# Altium schematic sheet Sensors.SchDoc
size A4; SheetNumber: 9
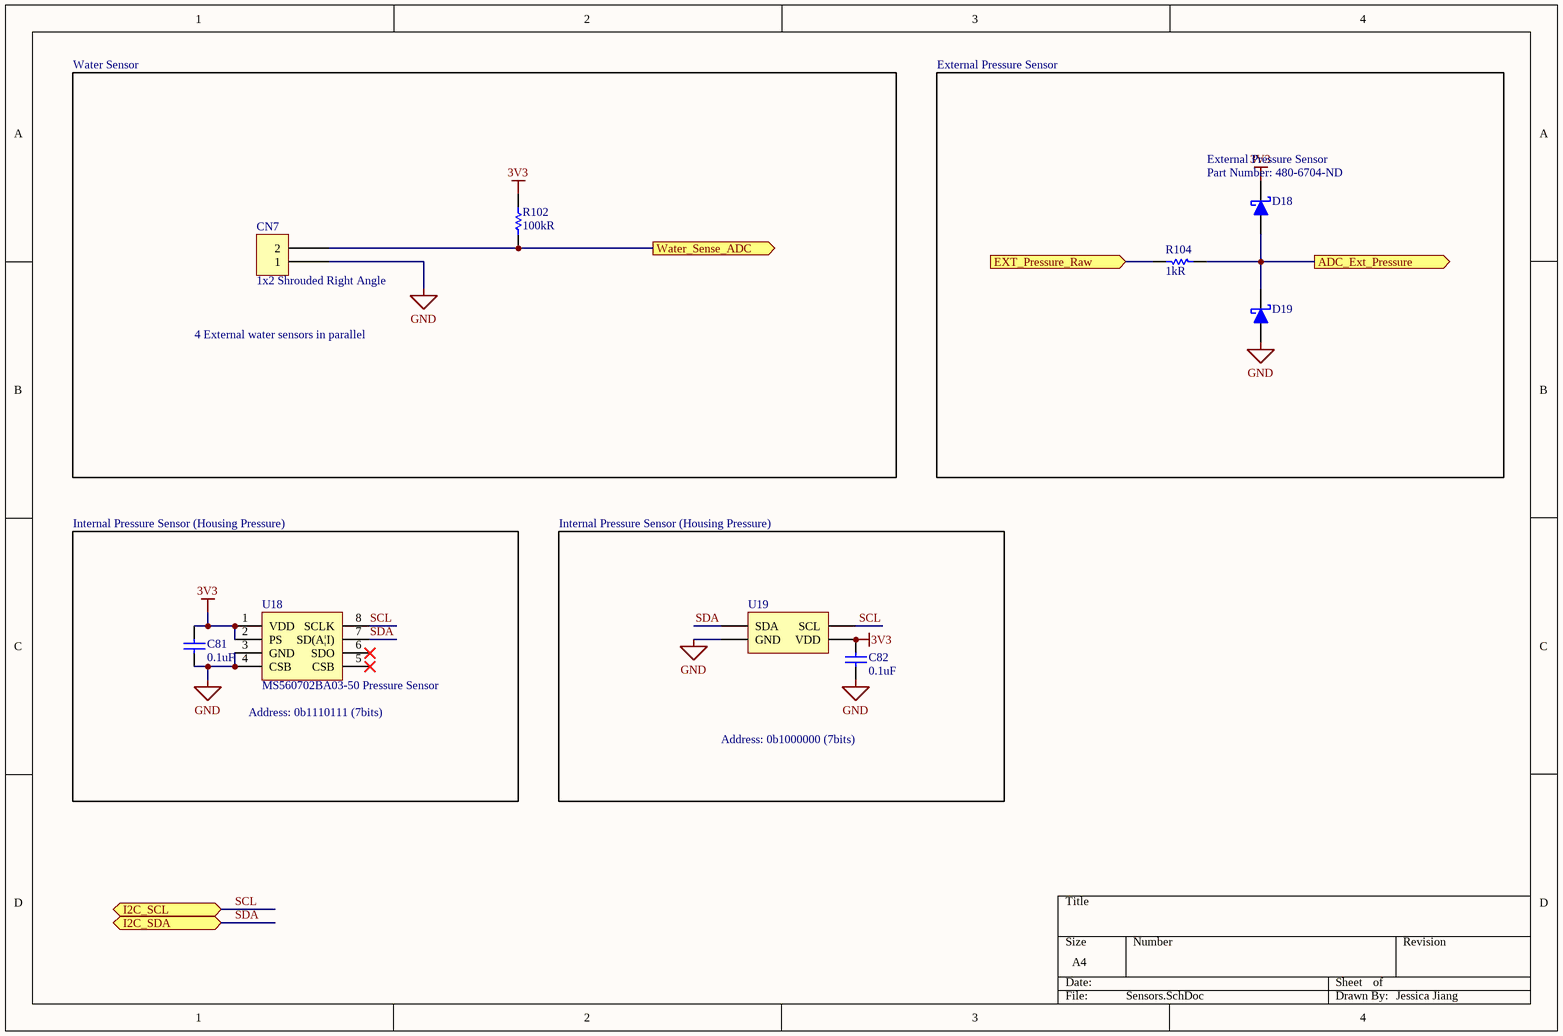
[diagram p0: Sensors.SchDoc]

## Parts
C81  Capacitance: 0.1uF  [FP-CL10-0_1-IPC_A]  (hidden comment: CL10B104JB8NNNC)
C82  Capacitance: 0.1uF  [FP-CL10-0_1-IPC_A]  (hidden comment: CL10B104JB8NNNC)
CN7  1x2 Shrouded Right Angle  [2X1 Female Header]
D18  CUS08F30,H3F  [SC-76]  (value not drawn)
D19  CUS08F30,H3F  [SC-76]  (value not drawn)
R102  Resistance: 100kR  [RESC1609X50X30ML10T20]  (hidden comment: CRCW0603-100KFKEA)
R104  Resistance: 1kR  [RESC1608X55X30ML15T15]  (hidden comment: ERJ3EKF1001V)
U18  MS560702BA03-50 Pressure Sensor  [TE Pressure Sensor (MS560702BA03-50)]
U19  Si700XX  [QFN-6]  (value not drawn)

## Ports
ADC_Ext_Pressure (out), EXT_Pressure_Raw (in), I2C_SCL (bidir), I2C_SDA (bidir), Water_Sense_ADC (out)

## Nets
3V3: C81.1 C82.1 D18.K(Cathode) R102.2 U18.1(VDD) U18.2(PS) U19.5(VDD)
GND: C81.2 C82.2 CN7.1 D19.A(Anode) U18.3(GND) U18.4(CSB) U19.2(GND)
ADC_Ext_Pressure: D18.A(Anode) D19.K(Cathode) R104.1 ; port ADC_Ext_Pressure
EXT_Pressure_Raw: R104.2 ; port EXT_Pressure_Raw
SCL: U18.8(SCLK) U19.6(SCL) ; port I2C_SCL
SDA: U18.7(SD(A|I)) U19.1(SDA) ; port I2C_SDA
Water_Sense_ADC: CN7.2 R102.1 ; port Water_Sense_ADC

Not connected (* = marked no-connect by the designer): U18 5(CSB)* 6(SDO)*

## Notes on the sheet
- Water Sensor
- External Pressure Sensor
- Part Number: 480-6704-ND
- 4 External water sensors in parallel
- Internal Pressure Sensor (Housing Pressure)
- (near U18) Address: 0b1110111 (7bits)
- Address: 0b1000000 (7bits)
- Jessica Jiang

## Library data of the parts
C81 C82 = CMP-00000-4: CAP CER 0.1UF 50V X7R 0603; Tolerance: 5%; Material: Ceramic; Case Code (Imperial): 0603; Mount: Surface Mount; Thickness: 0.035inch; Depth: 0.8mm; Packaging: Tape and Reel; Package Quantity: 1; Dielectric: X7R; Height: 0.8mm; Voltage: 50V; Radiation Hardening: No; Max Operating Temperature: 125°C; Voltage Rating: 50V; Case/Package: 0603; Min Operating Temperature: -55°C; Case Code (Metric): 1608; Length: 1.6mm; Contact Plating: Tin; Width: 0.031inch
CN7 = CMP-00010-3: 02 MTE HDR SRRA LATCH; PCB Mount Retention: Without; Number of Positions: 2; Row Spacing: 0.1inch; Contact Retention: Yes (With); PCB Mount Alignment: No (Without); Current Rating: 3A; PCB Thickness: 0.062inch; Insulation Resistance: 5GR; Gender: Male; Connector Type: Plug,Header,Pin; Tail Length: 3.3mm; Approvals: CSA; Pitch: 2.54mm; Contact Resistance: 15mR; Color: Black; REACH SVHC: Unknown; Contact Shape: Square; Number of Contacts: 2; PCB Mounting Orientation: Right Angle; Housing Material: Thermoplastic; Max Operating Temperature: 105°C; Mount: Through Hole; Package Quantity: 68; Contact Current Rating: 3A; Housing Color: Black; Contact Material: Brass; Min Operating Temperature: -65°C; Packaging: Rail/Tube; Height: 13.59mm; ELV: Compliant; Number of Rows: 1; Orientation: Right Angle; Lead Free: Lead Free; Mating Retention: Yes (With); Strain Relief: No (Without); Length: 7.62mm; Flammability Rating: UL94 V-0; Contact Plating: Gold,Tin,Matte; Contact Mating Length: 0.23inch; Contact Gender: Male; Termination: Crimp; Backwall/Post Interruptions: No (Without); Depth: 13.59mm; Mating Alignment: Yes (With)
D18 D19 = CMP-057-0000-2: Diode Schottky 30V 800mA Surface Mount USC; Peak Non-Repetitive Surge Current: 5A; Element Configuration: Single; Peak Reverse Current: 50uA; Packaging: Tape and Reel; Mount: Surface Mount; Average Rectified Current: 800mA; Case/Package: SOD; Max Reverse Voltage (DC): 30V; Min Operating Temperature: -55°C; Contact Plating: Tin,Silver; Max Repetitive Reverse Voltage (Vrrm): 30V; Number of Pins: 2; Max Operating Temperature: 125°C
R102 = CMP-00036-2: Resistor; Thick Film; 100 Kilohms; 0.1 W; 1%; SMT; 0603; TCR 37 ppm/DegC; Tape and Reel; Voltage Rating: 75V; Temperature Coefficient: 100ppm/°C; Power Rating: 100mW; Number of Terminations: 2; Number of Pins: 2; Contact Plating: Tin,Lead; Lead Free: Lead Free; Voltage Rating (DC): 75V; Package Quantity: 10; REACH SVHC: Unknown; Min Operating Temperature: -55°C; Height: 0.45mm; Composition: Thick Film; Case Code (Metric): 1608; Weight: 7.1E-05oz; Depth: 0.85mm; Features: Automotive AEC-Q200; Military Standard: Not; Tolerance: 1%; Radiation Hardening: No; Max Power Dissipation: 100mW; Case Code (Imperial): 0603; Max Operating Temperature: 155°C; Packaging: Tape and Reel; Width: 0.033inch; Case/Package: 0603; Termination: SMD/SMT; Length: 1.55mm
R104 = CMP-00062-2: Res Thick Film 0603 1K Ohm 1% 1/10W ±100ppm/°C Molded SMD Punched Carrier T/R; Voltage Rating: 75V; Max Power Dissipation: 100mW; Min Operating Temperature: -55°C; Radiation Hardening: No; Features: Automotive AEC-Q200; Length: 1.6mm; Mount: Surface Mount; Composition: Thick Film; Military Standard: Not; Tolerance: 1%; Height: 0.45mm; Depth: 0.8mm; Case Code (Imperial): 0603; Package Quantity: 5000; REACH SVHC: No SVHC; Termination: SMD/SMT; Temperature Coefficient: 100ppm/°C; Width: 0.8mm; Max Operating Temperature: 155°C; Lead Free: Lead Free; Voltage Rating (DC): 75V; Number of Pins: 2; Number of Terminations: 2; Contact Plating: Tin; Packaging: Tape and Reel; Case Code (Metric): 1608; Case/Package: 0603; Power Rating: 100mW
U18 = CMP-048-0005-2: 1kPa to 120 kPa; Made by: Andy Bates; Created on: 2017-09-11; Component Type: Standard; Source: AUVic_Schematic_Library_Sensors.SchLib; Design Item ID: MS560702BA03-50 Pressure Sensor; Pin Count: 8
U19 = CMP-048-0009-1: I2C Humidity and Temperature Sensor; Made by: Andy Bates; Design Item ID: Si700XX; Component Type: Standard; Pin Count: 4; Source: AUVic_Schematic_Library_Sensors.SchLib; Created on: 2019/09/08